# Altium project BluePill_Design.PrjPcb
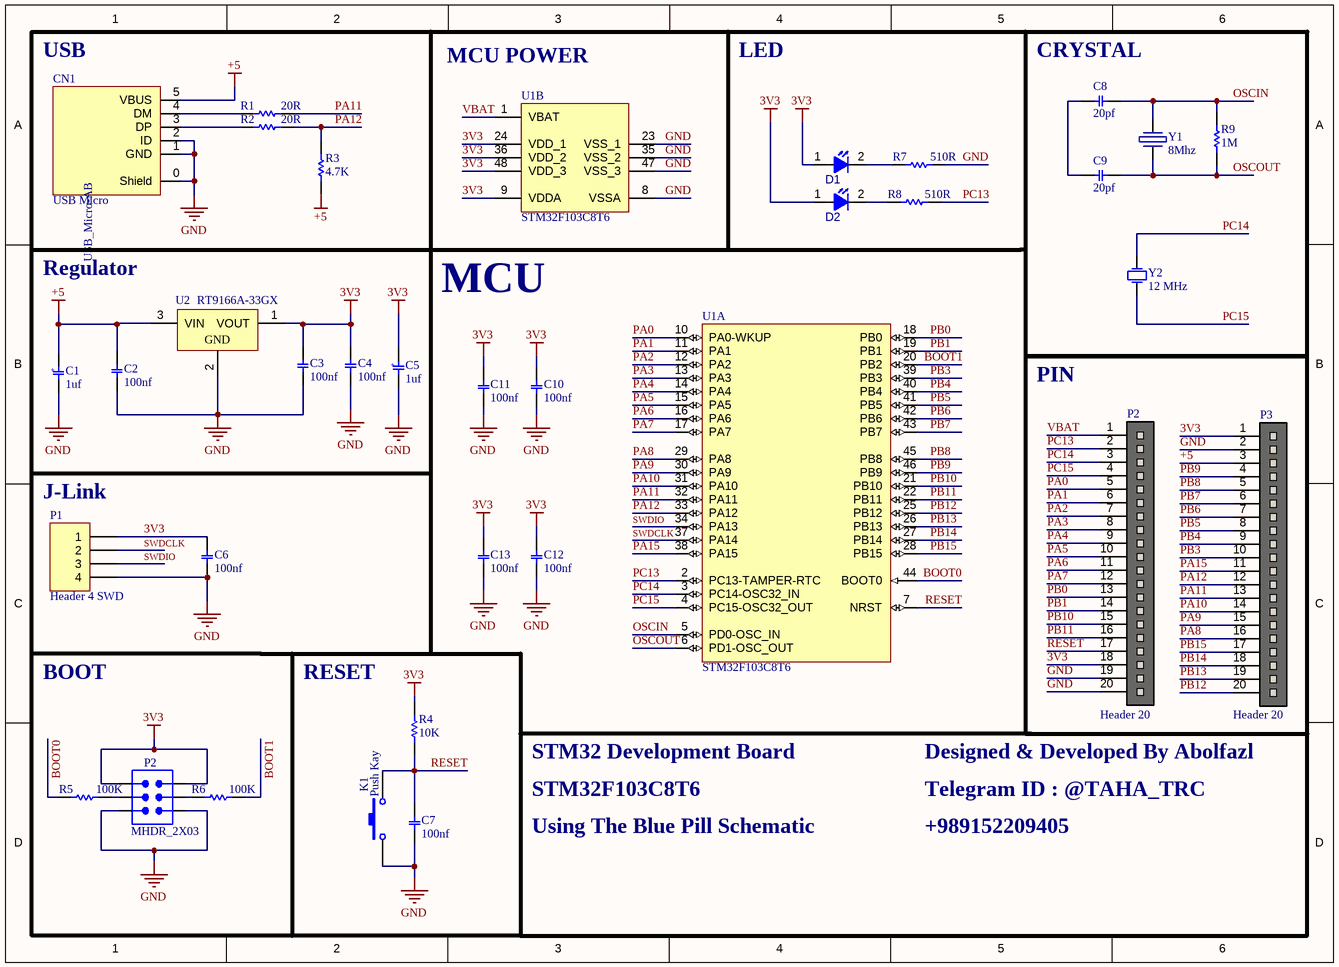
[diagram p0: BluePillSch.SchDoc]
1 sheet, 34 parts. Net scope: global (net labels, ports and power ports of the same name join across sheets).
Board file: BluePillPCB.PcbDoc

## Sheet BluePillSch.SchDoc
size 250 x 180 mm; SheetNumber: 1; SheetTotal: 1

### Parts
(Parts that share a designator on the sheet are numbered #1, #2 ... from top to bottom, then left to right.)
C1  value 1uf  [C_EL_4_5]  (hidden comment: Capacitor Electrical SMD)
C2  value 100nf  [C0805]  (hidden comment: Capacitor C SMD 0805)
C3  value 100nf  [C0805]  (hidden comment: Capacitor C SMD 0805)
C4  value 100nf  [C0805]  (hidden comment: Capacitor C SMD 0805)
C5  value 1uf  [C_EL_4_5]  (hidden comment: Capacitor Electrical SMD)
C6  value 100nf  [C0805]  (hidden comment: Capacitor C SMD 0805)
C7  value 100nf  [C0805]  (hidden comment: Capacitor C SMD 0805)
C8  value 20pf  [C0805]  (hidden comment: Capacitor C SMD 0805)
C9  value 20pf  [C0805]  (hidden comment: Capacitor C SMD 0805)
C10  value 100nf  [C0805]  (hidden comment: Capacitor C SMD 0805)
C11  value 100nf  [C0805]  (hidden comment: Capacitor C SMD 0805)
C12  value 100nf  [C0805]  (hidden comment: Capacitor C SMD 0805)
C13  value 100nf  [C0805]  (hidden comment: Capacitor C SMD 0805)
CN1  USB Micro  [Usb micro female 5-pin]
D1  LED SMD 0805  [LED SMD 0805 (Blue)]  (value not drawn)
D2  LED SMD 0805  [LED SMD 0805 (Green)]  (value not drawn)
K1  Push Kay  [SW_KFC]
P1  Header 4 SWD  [HDR1X4]
P2#1  Header 20  [HDR 1X20]
P2#2  MHDR_2X03  [MHDR2X03-254P - E]
P3  Header 20  [HDR 1X20]
R1  value 20R  [R0805]  (hidden comment: Resistor SMD 0805)
R2  value 20R  [R0805]  (hidden comment: Resistor SMD 0805)
R3  value 4.7K  [R0805]  (hidden comment: Resistor SMD 0805)
R4  value 10K  [R0805]  (hidden comment: Resistor SMD 0805)
R5  value 100K  [R0805]  (hidden comment: Resistor SMD 0805)
R6  value 100K  [R0805]  (hidden comment: Resistor SMD 0805)
R7  value 510R  [R0805]  (hidden comment: Resistor SMD 0805)
R8  value 510R  [R0805]  (hidden comment: Resistor SMD 0805)
R9  value 1M  [R0805]  (hidden comment: Resistor SMD 0805)
U1  STM32F103C8T6  [STM-LQFP48_N]  (parts A,B of 2)
U2  RT9166A-33GX  [MY_SOT-89]
Y1  8Mhz  [Xtal 2p COMBO]
Y2  12 MHz  [XTAL RTC]

### Blocks framed on the sheet
PIN: P2#1 P3

### Nets
3V3: C3.2 C4.2 C5.2 C6.2 C10.2 C11.2 C12.2 C13.2 D1.1(ANODE) D2.1(ANODE) P1.1 P2#1.18 P2#2.1 P2#2.2 P3.1 R4.2 U1.9(VDDA) U1.24(VDD_1) U1.36(VDD_2) U1.48(VDD_3) U2.1(VOUT)
+5: C1.2 C2.2 CN1.5(VBUS) P3.3 R3.2 U2.3(VIN)
GND: C1.1 C2.1 C3.1 C4.1 C5.1 C6.1 C7.1 C10.1 C11.1 C12.1 C13.1 CN1.0(Shield) CN1.1(GND) CN1.2(ID) K1.1 P1.4 P2#1.19 P2#1.20 P2#2.5 P2#2.6 P3.2 R7.2 U1.8(VSSA) U1.23(VSS_1) U1.35(VSS_2) U1.47(VSS_3) U2.2(GND)
BOOT0: R5.1 U1.44(BOOT0)
BOOT1: R6.2 U1.20(PB2)
OSCIN: C8.2 R9.2 U1.5(PD0-OSC_IN) Y1.1
OSCOUT: C9.2 R9.1 U1.6(PD1-OSC_OUT) Y1.2
PA0: P2#1.5 U1.10(PA0-WKUP)
PA1: P2#1.6 U1.11(PA1)
PA2: P2#1.7 U1.12(PA2)
PA3: P2#1.8 U1.13(PA3)
PA4: P2#1.9 U1.14(PA4)
PA5: P2#1.10 U1.15(PA5)
PA6: P2#1.11 U1.16(PA6)
PA7: P2#1.12 U1.17(PA7)
PA8: P3.16 U1.29(PA8)
PA9: P3.15 U1.30(PA9)
PA10: P3.14 U1.31(PA10)
PA11: P3.13 R1.2 U1.32(PA11)
PA12: P3.12 R2.2 R3.1 U1.33(PA12)
PA15: P3.11 U1.38(PA15)
PB0: P2#1.13 U1.18(PB0)
PB1: P2#1.14 U1.19(PB1)
PB3: P3.10 U1.39(PB3)
PB4: P3.9 U1.40(PB4)
PB5: P3.8 U1.41(PB5)
PB6: P3.7 U1.42(PB6)
PB7: P3.6 U1.43(PB7)
PB8: P3.5 U1.45(PB8)
PB9: P3.4 U1.46(PB9)
PB10: P2#1.15 U1.21(PB10)
PB11: P2#1.16 U1.22(PB11)
PB12: P3.20 U1.25(PB12)
PB13: P3.19 U1.26(PB13)
PB14: P3.18 U1.27(PB14)
PB15: P3.17 U1.28(PB15)
PC13: P2#1.2 R8.2 U1.2(PC13-TAMPER-RTC)
PC14: P2#1.3 U1.3(PC14-OSC32_IN) Y2.2(OSC2)
PC15: P2#1.4 U1.4(PC15-OSC32_OUT) Y2.1(OSC1)
RESET: C7.2 K1.2 P2#1.17 R4.1 U1.7(NRST)
SWDCLK: P1.2 U1.37(PA14)
SWDIO: P1.3 U1.34(PA13)
VBAT: P2#1.1 U1.1(VBAT)
NetC8_1: C8.1 C9.1
NetCN1_3: CN1.3(DP) R2.1
NetCN1_4: CN1.4(DM) R1.1
NetD1_2: D1.2(CATHODE) R7.1
NetD2_2: D2.2(CATHODE) R8.1
NetP2#2_3: P2#2.3 R5.2
NetP2#2_4: P2#2.4 R6.1

### Notes on the sheet
- USB
- (near U1) MCU POWER
- LED
- (near C8) CRYSTAL
- Regulator
- MCU
- (near P1) J-Link
- BOOT
- RESET
- STM32 Development Board
- Designed & Developed By Abolfazl
- STM32F103C8T6
- Using The Blue Pill Schematic
- Telegram ID : @TAHA_TRC
- +989152209405
- THIS DOCUMENT AND THE DATA DISCLOSED HEREIN OR
- HEREWITH IS THE PROPERTY OF ALTIUM LIMITED AND MAY
- DWG NO:
- REVISION
- REV:
- DESCRIPTION
- DATE
- APPROVED
- BE FREELY DISTRIBUTED IN WHOLE. NO RIGHTS ARE
- RESERVED OR EXPRESS OR IMPLIED WARANTEE GIVEN.
- ENG:
- APPROVALS
- PROJECT
- DSN:
- CHK:
- REFERENCE DOCUMENTS
- PROJECT REVISION:
- TITLE
- DOCUMENT REVISION:
- DESIGN ITEM:
- BOM:
- FAB DWG:
- PCB DWG:
- ASSY DWG:
- SCALE:
- A3
- SIZE
- CAGE CODE
- FILE NAME
- DWG NO.
- SHEET
- OF
- REV
- (in symbol Capacitor Electrical SMD) +
- (in symbol Usb micro female 5-pin) USB_Micro-AB

### Library data of the parts
CN1 = Usb micro female 5-pin
P1 = Header 4: Header, 4-Pin; LatestRevisionDate: 17-Jul-2002; LatestRevisionNote: Re-released for DXP Platform.; Publisher: Altium Limited
P2#1 P3 = Header 20: Header, 20-Pin; ComponentLinkp-URL: https://www.smartw.ir/; DatasheetVersion: 2020
P2#2 = MHDR_2X03: Male Header 2X03
U1 = STM32F103C8T6: ARM Cortex-M3 32-bit MCU, 64 KB Flash, 20 KB Internal RAM, 37 I/Os, 48-pin LQFP, -40 to 85 degC, Tray; ComponentLink1Description: Website Smart World; ComponentLink1URL: https://www.smartw.ir/
U2 = RT9166A-33GX: Positive Voltage Regulator, 3.3V, 3-Pin SOT-89; PartNumber: L78L05ACUTR; DatasheetVersion: Feb-2011; PackageVersion: 2011; PackageReference: SOT-89; PackageDescription: 3-Pin SOT-89 Package 1.5 mm Pitch, 4.1 mm Lead Span; ComponentLink1Description: Manufacturer URL; ComponentLink1URL: http://www.st.com; ComponentLink2Description: Datasheet; ComponentLink2URL: http://www.st.com/internet/com/TECHNICAL_RESOURCES/TECHNICAL_LITERATURE/DATASHEET/CD00000446.pdf
Y1 = Xtal
Y2 = XTAL: XTAL Crystal; Designer: ABBAS BASEREH; Design Date: 2017-1-3; ComponentLink1Description: Datasheet; ComponentLink2Description: Reference; Mounting Technology: Surface Mount\Through-Hole; Value: 12 MHz; Status: Unreleased
C1 C5 = Capacitor Electrical SMD: DatasheetVersion: 2021; ComponentLink1Description: Website Smart World; ComponentLink1URL: https://www.smartw.ir/; ComponentLink2Description: Telegram; ComponentLink2URL: https://t.me/altium_smartw; ComponentLink3Description: Instagram; ComponentLink3URL: https://Instagram.com/smartgw.ir
C2-C4 C6-C13 = Capacitor C SMD 0805: DatasheetVersion: 2021; ComponentLink1Description: Website Smart World; ComponentLink1URL: https://www.smartw.ir/; ComponentLink2Description: Telegram; ComponentLink2URL: https://t.me/altium_smartw; ComponentLink3Description: Instagram; ComponentLink3URL: https://Instagram.com/smartgw.ir
D1 D2 = LED SMD 0805: ComponentLink1Description: Website Smart World; ComponentLink1URL: https://www.smartw.ir/; ComponentLink2Description: Telegram; ComponentLink2URL: https://t.me/altium_smartw; ComponentLink3Description: Instagram; ComponentLink3URL: https://Instagram.com/smartgw.ir; DatasheetVersion: 2021
R1-R9 = Resistor SMD 0805: DatasheetVersion: 2021; ComponentLink1Description: Website Smart World; ComponentLink1URL: https://www.smartw.ir/; ComponentLink2Description: Telegram; ComponentLink2URL: https://t.me/altium_smartw; ComponentLink3Description: Instagram; ComponentLink3URL: https://Instagram.com/smartgw.ir